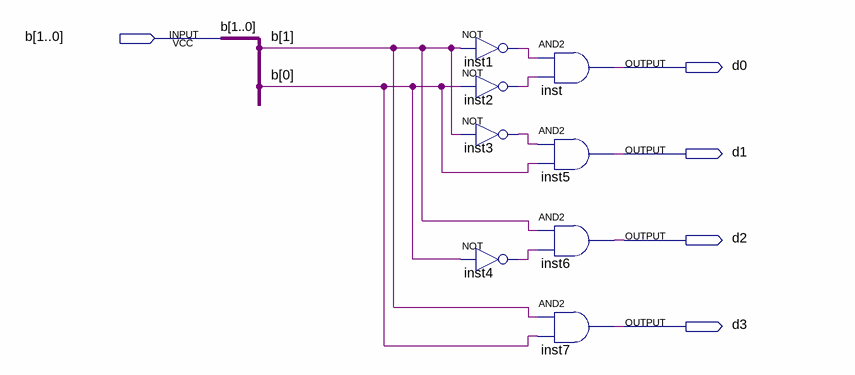
[diagram p0: schematic sheet]
// Quartus schematic b2d_2bit.bdf as structural Verilog: 8 symbols, 5 pins
module b2d_2bit (
  input  [1:0] b,
  output d0,
  output d1,
  output d2,
  output d3
);

  wire inst1_out, inst2_out, inst3_out, inst4_out;

  not inst1 (inst1_out, b[1]);
  not inst2 (inst2_out, b[0]);
  not inst3 (inst3_out, b[1]);
  not inst4 (inst4_out, b[0]);
  and inst (d0, inst1_out, inst2_out);
  and inst5 (d1, inst3_out, b[0]);
  and inst6 (d2, b[1], inst4_out);
  and inst7 (d3, b[1], b[0]);
endmodule
